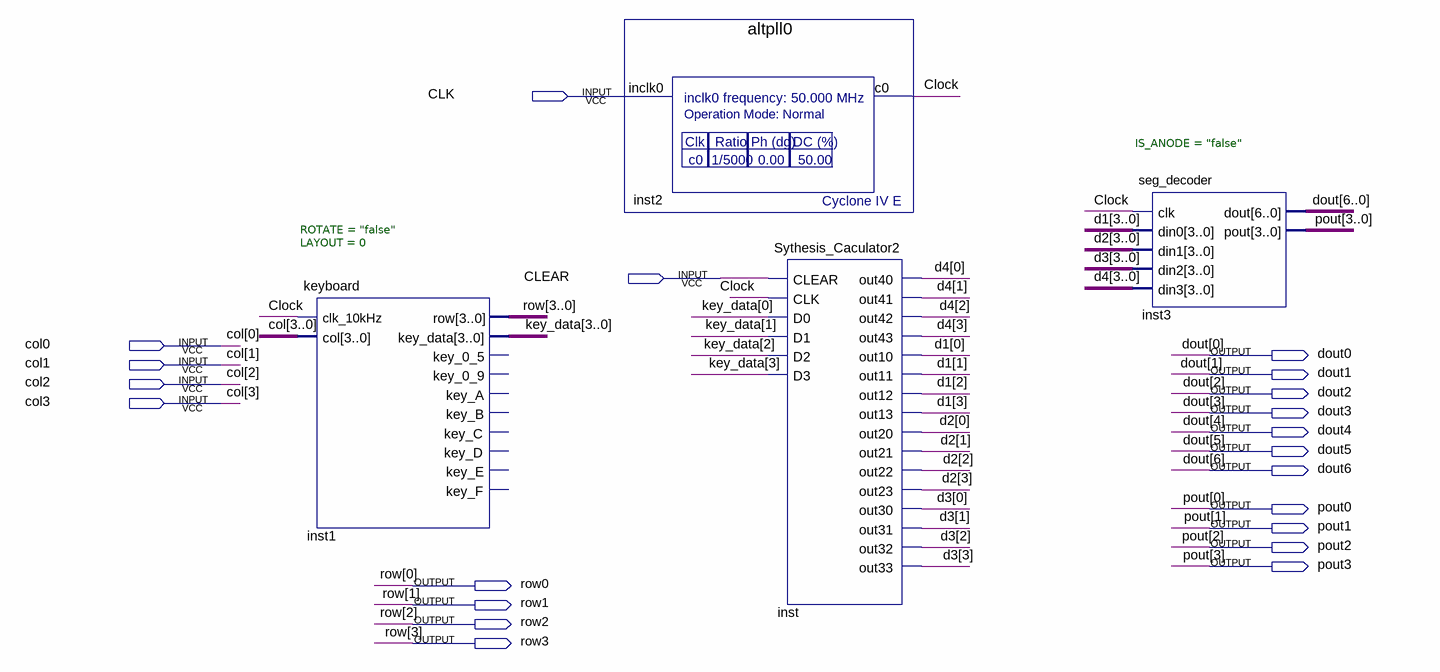
[diagram p0: schematic sheet]
// Quartus schematic Full_Calculator3.0.bdf as structural Verilog: 4 symbols, 21 pins
module \Full_Calculator3.0  (
  input  CLK,
  input  CLEAR,
  input  col0,
  input  col1,
  input  col2,
  input  col3,
  output dout0,
  output dout1,
  output dout2,
  output dout3,
  output dout4,
  output dout5,
  output dout6,
  output pout0,
  output pout1,
  output pout2,
  output pout3,
  output row0,
  output row1,
  output row2,
  output row3
);

  wire Clock;
  wire [3:0] d1, d2, d3, d4, key_data;

  keyboard #(.ROTATE("false"), .LAYOUT(0)) inst1 (
    .clk_10kHz(Clock), .col({col3, col2, col1, col0}), .row({row3, row2, row1, row0}), .key_data(key_data));  // open: key_0_5, key_0_9, key_A, key_B, key_C, key_D, key_E, key_F
  altpll0 inst2 (.inclk0(CLK), .c0(Clock));
  Sythesis_Caculator2 inst (
    .CLEAR(CLEAR), .CLK(Clock), .D0(key_data[0]), .D1(key_data[1]), .D2(key_data[2]), .D3(key_data[3]),
    .out40(d4[0]), .out41(d4[1]), .out42(d4[2]), .out43(d4[3]), .out10(d1[0]), .out11(d1[1]), .out12(d1[2]),
    .out13(d1[3]), .out20(d2[0]), .out21(d2[1]), .out22(d2[2]), .out23(d2[3]), .out30(d3[0]), .out31(d3[1]),
    .out32(d3[2]), .out33(d3[3]));
  seg_decoder #(.IS_ANODE("false")) inst3 (
    .clk(Clock), .din0(d1), .din1(d2), .din2(d3), .din3(d4),
    .dout({dout6, dout5, dout4, dout3, dout2, dout1, dout0}), .pout({pout3, pout2, pout1, pout0}));
endmodule
